# EAGLE design PICv2 (EAGLE 9.3.0)
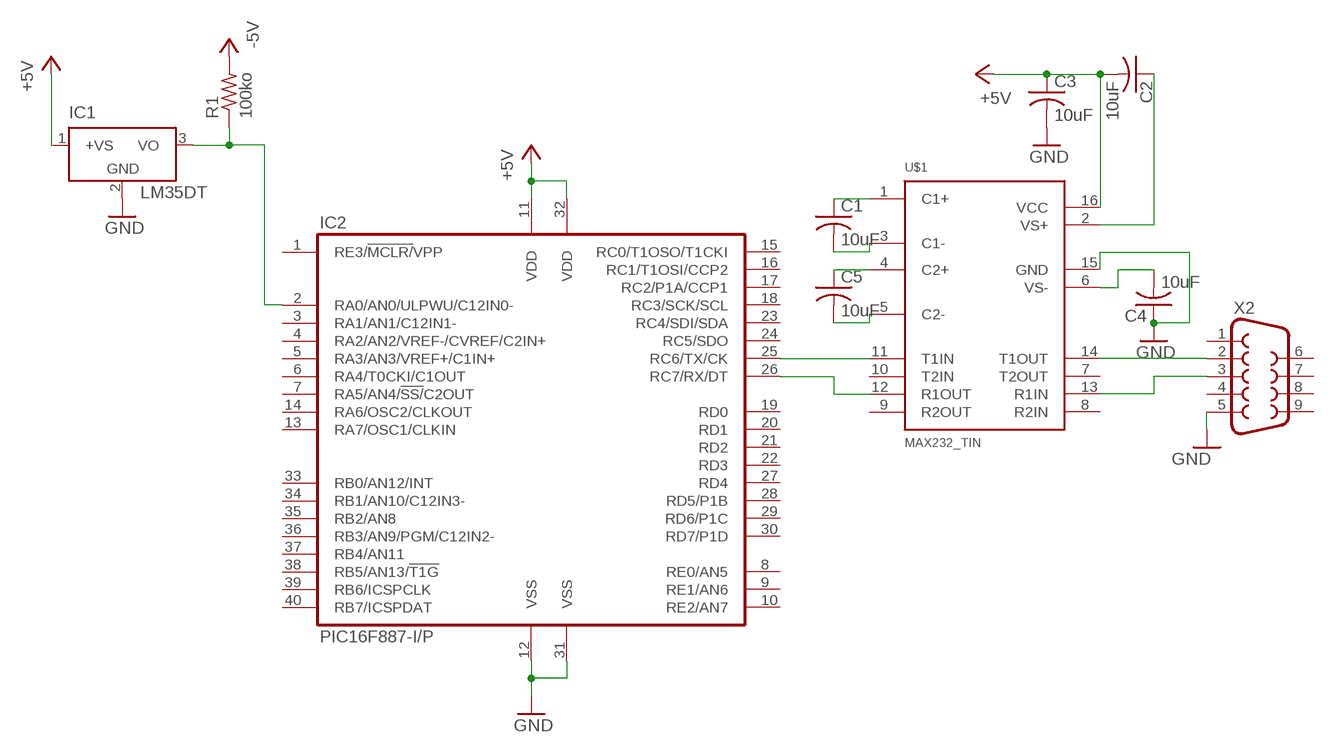
[diagram p0: schematic, sheet 1]

## Parts
C1  10uF  C-USC0805  [C0805]
C2  10uF  C-USC0805  [C0805]
C3  10uF  C-USC0805  [C0805]
C4  10uF  C-USC0805  [C0805]
C5  10uF  C-USC0805  [C0805]
IC1  LM35DT  [TO220V]
IC2  PIC16F887-I/P  [DIL40]
R1  100ko  R-US_M0805  [M0805]
U$1  MAX232_TIN  [DIL16]
X2  F09D  [F09D]

## Nets
+5V: C2.2 C3.1 IC1.1(+VS) IC2.11(VDD) IC2.32(VDD) U$1.16(VCC)
-5V: R1.2
GND: C3.2 C4.1 IC1.2(GND) IC2.12(VSS) IC2.31(VSS) U$1.15(GND) X2.5
N$1: C1.1 U$1.1(C1+)
N$2: C1.2 U$1.3(C1-)
N$3: C5.1 U$1.4(C2+)
N$4: C5.2 U$1.5(C2-)
N$5: IC1.3(VO) IC2.2(RA0/AN0/ULPWU/C12IN0-) R1.1
N$6: C2.1 U$1.2(VS+)
N$7: C4.2 U$1.6(VS-)
N$8: IC2.25(RC6/TX/CK) U$1.11(T1IN)
N$9: IC2.26(RC7/RX/DT) U$1.12(R1OUT)
N$10: U$1.14(T1OUT) X2.2
N$11: U$1.13(R1IN) X2.3
Unconnected: IC2.1(RE3/!MCLR/!VPP) IC2.3(RA1/AN1/C12IN1-) IC2.4(RA2/AN2/VREF-/CVREF/C2IN+) IC2.5(RA3/AN3/VREF+/C1IN+) IC2.6(RA4/T0CKI/C1OUT) IC2.7(RA5/AN4/!SS/!C2OUT) IC2.8(RE0/AN5) IC2.9(RE1/AN6) IC2.10(RE2/AN7) IC2.13(RA7/OSC1/CLKIN) IC2.14(RA6/OSC2/CLKOUT) IC2.15(RC0/T1OSO/T1CKI) IC2.16(RC1/T1OSI/CCP2) IC2.17(RC2/P1A/CCP1) IC2.18(RC3/SCK/SCL) IC2.19(RD0) IC2.20(RD1) IC2.21(RD2) IC2.22(RD3) IC2.23(RC4/SDI/SDA) IC2.24(RC5/SDO) IC2.27(RD4) IC2.28(RD5/P1B) IC2.29(RD6/P1C) IC2.30(RD7/P1D) IC2.33(RB0/AN12/INT) IC2.34(RB1/AN10/C12IN3-) IC2.35(RB2/AN8) IC2.36(RB3/AN9/PGM/C12IN2-) IC2.37(RB4/AN11) IC2.38(RB5/AN13/!T1G) IC2.39(RB6/ICSPCLK) IC2.40(RB7/ICSPDAT) U$1.7(T2OUT) U$1.8(R2IN) U$1.9(R2OUT) U$1.10(T2IN) X2.1 X2.4 X2.6 X2.7 X2.8 X2.9

## Library data of the parts
C1-C5 = adafruit:C-US: CAPACITOR, American symbol; MPN: CGA2B1X7R1C104K050BC; OC_NEWARK: 04X3141
IC1 = lm35:LM35: Single-Supply Centigrade Temperature Sensor Vout = (10mV/°C x Temp °C) +5mmmV Source: http://www.national.com/ds/LM/LM35.pdf; MF: NATIONAL SEMICONDUCTOR; MPN: LM35AH; OC_NEWARK: 83F3871
IC2 = microchip-pic16f887:PIC16F887: The library has been designed by Richard Magdycz <https://www.facebook.com/groups/eaglecadsoftUK>; MPN: PIC16F887-I/P; OC_NEWARK: 27M9657
R1 = adafruit:R-US_: RESISTOR, American symbol; MPN: ERJ-1GNF1003C; OC_NEWARK: 05X8797
U$1 = max232ti_n:MAX232_TI: MAX232, Texas Instruments Version; MPN: MAX232EIDR; OC_NEWARK: 94T5006
X2 = con-subd:F09: SUB-D; OC_FARNELL: unknown; OC_NEWARK: unknown

## Net classes
0 default: width 0.305 mm, drill 0.508 mm, clearance 0.254 mm

## Board
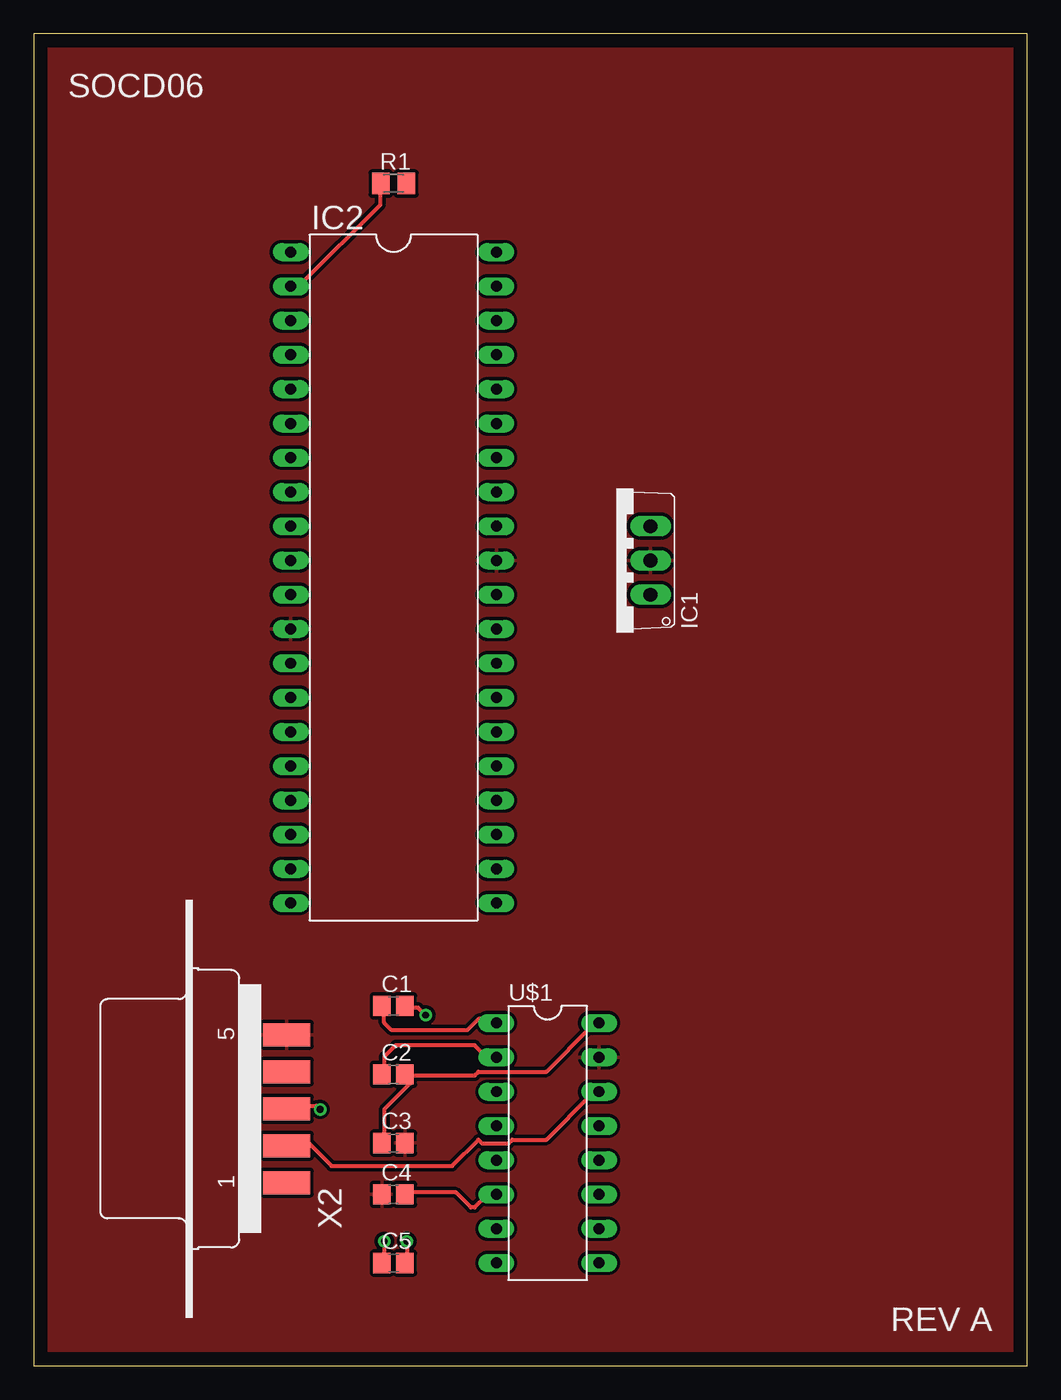
[diagram p1: board, top side]
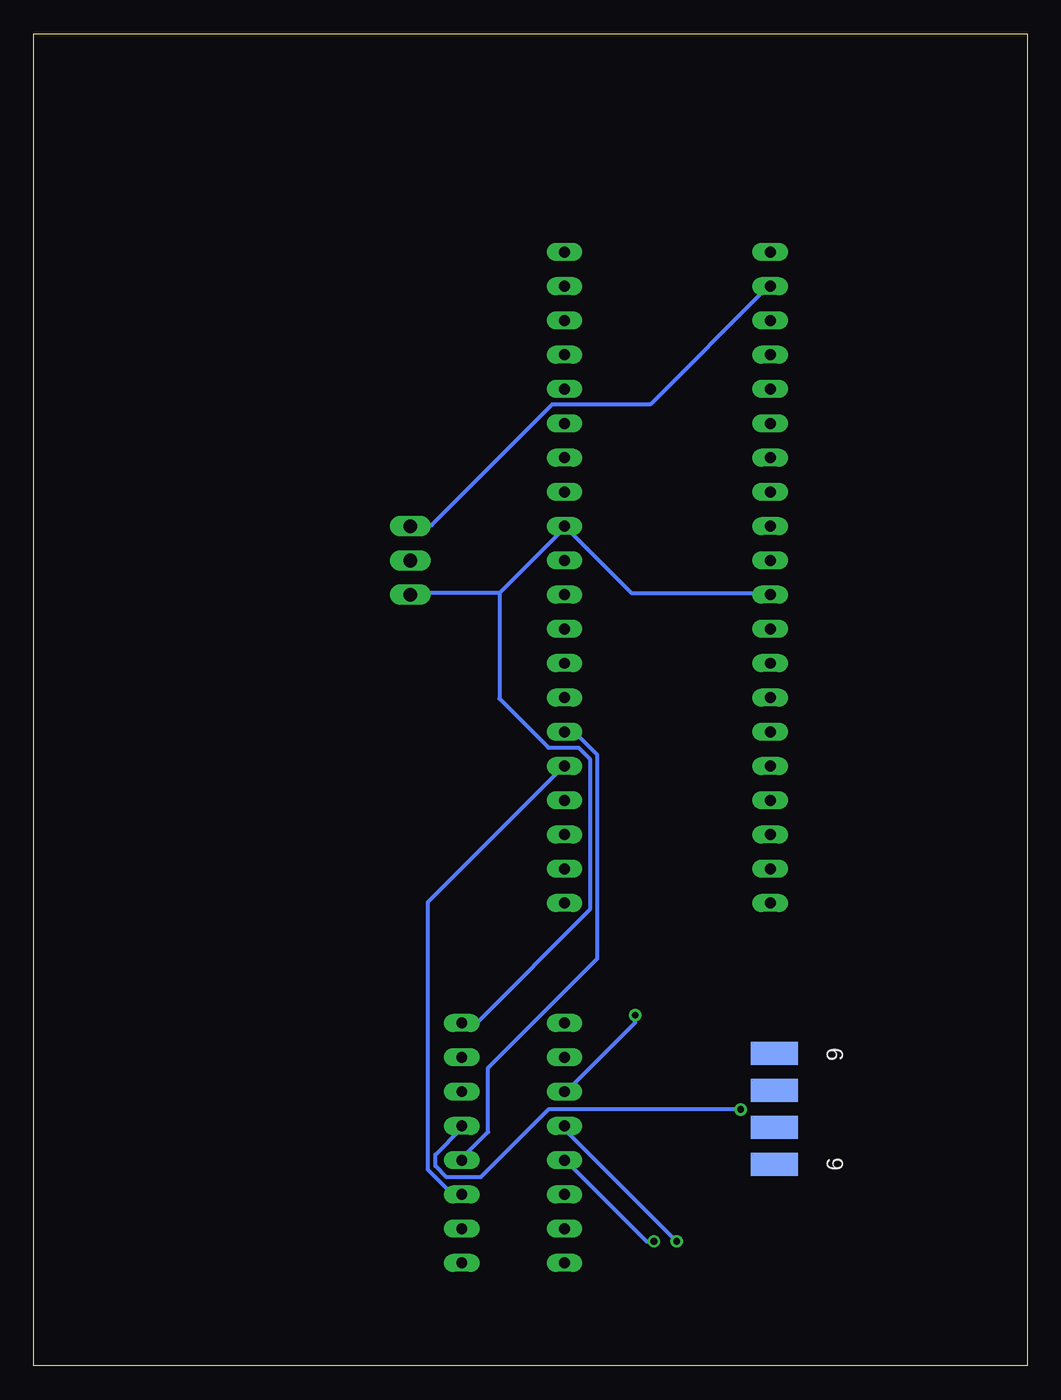
[diagram p2: board, bottom side, seen from below]

Size 73.64 x 98.73 mm. Coordinates in mm from the lower left corner, seen from the top.
Outline: 0,0 73.64,0 73.64,98.73 0,98.73 0,0
Copper layers (1*16): Top 0.035mm / dielectric 1.5mm / Bottom 0.035mm
Design rules "default": minimum track width 6mil, minimum drill 0.35mm, track to track 6mil, track to pad 6mil, pad to pad 6mil, via to via 6mil, smd to smd 6mil, copper to edge 40mil, drill to drill 6mil, minimum pad ring 10mil, minimum via ring 8mil, stop-mask expansion 4mil, vias tented up to drill 0mil, thermal gap 10mil

### Footprints (pad centres in the part's own frame; a part is rotated, then mirrored left to right if it is on the bottom)
C0805 = smd 1.3 x 1.5: 1 -0.85,0; 2 0.85,0
TO220V = drill 1.016 long: 1 -2.54,-2.54; 2 0,-2.54; 3 2.54,-2.54
DIL40 = drill 0.813 long: 1 -24.13,-7.62; 2 -21.59,-7.62; 3 -19.05,-7.62; 4 -16.51,-7.62; 5 -13.97,-7.62; 6 -11.43,-7.62; 7 -8.89,-7.62; 8 -6.35,-7.62; 9 -3.81,-7.62; 10 -1.27,-7.62; 11 1.27,-7.62; 12 3.81,-7.62; 13 6.35,-7.62; 14 8.89,-7.62; 15 11.43,-7.62; 16 13.97,-7.62; 17 16.51,-7.62; 18 19.05,-7.62; 19 21.59,-7.62; 20 24.13,-7.62; 21 24.13,7.62; 22 21.59,7.62; 23 19.05,7.62; 24 16.51,7.62; 25 13.97,7.62; 26 11.43,7.62; 27 8.89,7.62; 28 6.35,7.62; 29 3.81,7.62; 30 1.27,7.62; 31 -1.27,7.62; 32 -3.81,7.62; 33 -6.35,7.62; 34 -8.89,7.62; 35 -11.43,7.62; 36 -13.97,7.62; 37 -16.51,7.62; 38 -19.05,7.62; 39 -21.59,7.62; 40 -24.13,7.62
M0805 = smd 1.3 x 1.6: 1 -0.95,0; 2 0.95,0
DIL16 = drill 0.813 long: 1 -8.89,-3.81; 2 -6.35,-3.81; 3 -3.81,-3.81; 4 -1.27,-3.81; 5 1.27,-3.81; 6 3.81,-3.81; 7 6.35,-3.81; 8 8.89,-3.81; 9 8.89,3.81; 10 6.35,3.81; 11 3.81,3.81; 12 1.27,3.81; 13 -1.27,3.81; 14 -3.81,3.81; 15 -6.35,3.81; 16 -8.89,3.81
F09D = smd 1.7 x 3.5: 1 -5.486,-6.045; 2 -2.743,-6.045; 3 0,-6.045; 4 2.743,-6.045; 5 5.486,-6.045 | smd 1.7 x 3.5 bottom: 6 -4.115,-6.045; 7 -1.372,-6.045; 8 1.372,-6.045; 9 4.115,-6.045

### Placement (x,y rotation side)
C1  26.67,26.67 0 top
C2  26.67,21.59 0 top
C3  26.67,16.51 0 top
C4  26.67,12.7 0 top
C5  26.67,7.62 0 top
IC1  43.18,59.69 90 top
IC2  26.67,58.42 270 top
R1  26.67,87.63 0 top
U$1  38.1,16.51 270 top
X2  12.7,19.05 90 top

### Tracks (layer width: path | path; a pad name or v marks a point on that pad's centre or on a via)
+5V
  Top 0.305: 27.66,21.51 27.94,21.23 27.94,20.95 25.98,19 25.98,16.76 C3.1 | 27.66,21.51 C2.2 27.66,21.51 | 27.66,21.51 32.69,21.51 32.97,21.79 38,21.79 41.35,25.15 41.91,25.15 U$1.16
  Bottom 0.305: IC2.11 19.28,57.28 29.34,57.28 34.09,62.03 IC2.32 34.37,62.03 39.12,57.28 | 39.12,57.28 45.54,57.28 IC1.1 | 39.12,57.28 39.12,49.45 35.48,45.82 33.25,45.82 32.41,44.98 32.41,33.81 40.79,25.43 41.91,25.43 U$1.16
GND
  pour Top: -3.81,101.6 77.47,101.6 77.47,-2.54 -3.81,-2.54
N$1
  Top 0.305: C1.1 25.98,26.54 25.98,25.43 26.54,24.87 32.13,24.87 32.97,25.7 33.81,25.7 34.09,25.43 U$1.1
N$2  (via drill 0.51)
  Top 0.305: v29.06,25.98 28.5,26.54 27.66,26.54 C1.2
  Bottom 0.305: v29.06,25.98 29.06,25.43 34.09,20.4 U$1.3
N$3  (via drill 0.51)
  Top 0.305: v25.98,9.22 25.98,7.82 C5.1
  Bottom 0.305: v25.98,9.22 34.37,17.6 U$1.4
N$4  (via drill 0.51)
  Top 0.305: v27.66,9.22 27.66,7.82 C5.2
  Bottom 0.305: v27.66,9.22 28.22,9.22 34.09,15.09 U$1.5
N$5
  Top 0.305: R1.1 25.7,87.45 25.7,86.06 19.84,80.19 19.28,80.19 IC2.2
  Bottom 0.305: IC1.3 45.54,62.31 44.15,62.31 35.2,71.25 27.94,71.25 19.28,79.91 IC2.2
N$6
  Top 0.305: C2.1 25.98,21.79 25.98,22.91 26.82,23.75 32.69,23.75 33.53,22.91 34.09,22.91 U$1.2
N$7
  Top 0.305: C4.2 27.66,12.85 31.29,12.85 32.41,11.73 32.69,11.73 33.53,12.57 34.09,12.57 U$1.6
N$8
  Bottom 0.305: IC2.25 34.37,44.42 44.42,34.37 44.42,14.53 42.75,12.85 41.91,12.85 U$1.11
N$9
  Bottom 0.305: IC2.26 34.09,46.94 33.53,46.94 31.85,45.26 31.85,30.18 39.95,22.07 39.95,17.32 41.91,15.37 U$1.12
N$10
  Top 0.305: U$1.14 41.91,20.12 41.35,20.12 38,16.76 35.48,16.76 35.2,16.48 33.25,16.48 32.97,16.76 31.01,14.81 22.07,14.81 20.4,16.48 19,16.48 X2.2
N$11  (via drill 0.51)
  Top 0.305: v21.23,19 20.95,19.28 19,19.28 X2.3
  Bottom 0.305: v21.23,19 35.48,19 40.51,13.97 43.03,13.97 43.87,14.81 43.87,15.65 41.91,17.6 U$1.13

### Text on the board
tPlace: SOCD06 | REV A